# Altium project obc-comm v2.PrjPCB
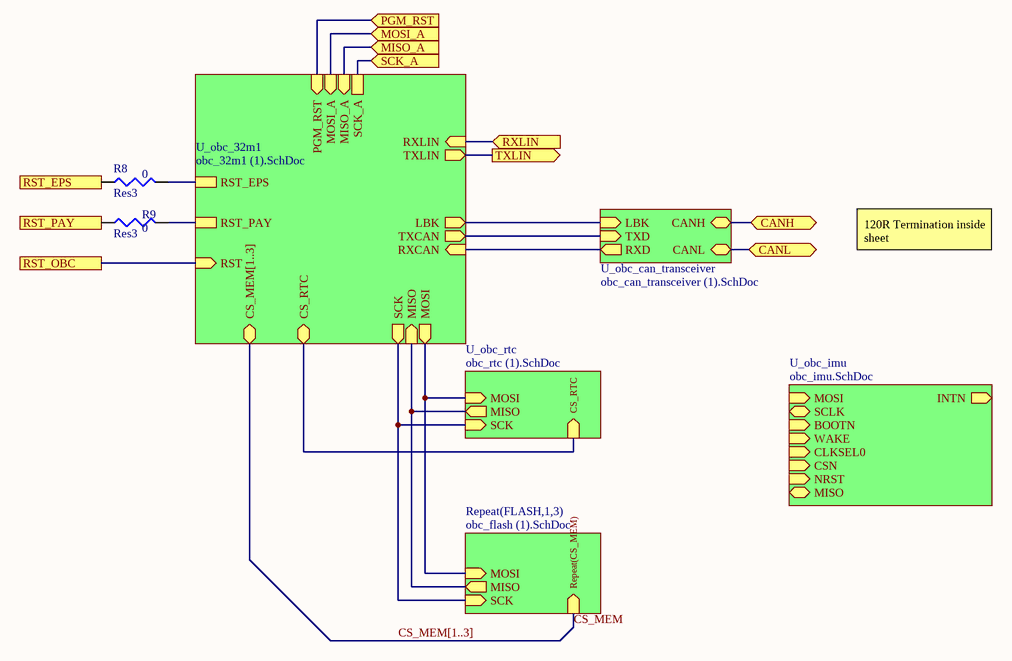
[diagram p0: obc_main_3.0 (1).SchDoc]
5 sheets, 56 parts. Net scope: hierarchical (ports join the sheet entries above them; power ports are global).
Board file: obc-comm v2.PcbDoc
Sheets:
  obc_main_3.0 (1).SchDoc
    U_obc_32m1 = obc_32m1 (1).SchDoc
    U_obc_can_transceiver = obc_can_transceiver (1).SchDoc
    FLASH1 = obc_flash (1).SchDoc
    FLASH2 = obc_flash (1).SchDoc
    FLASH3 = obc_flash (1).SchDoc
    U_obc_imu = obc_imu.SchDoc

## Sheet obc_main_3.0 (1).SchDoc
size A

### Parts
R8  Res3  value 0  [J1-0603]
R9  Res3  value 0  [J1-0603]

### Sub-sheets
Repeat(FLASH,1,3) = obc_flash (1).SchDoc: MOSI (in), SCK (in), MISO (out), Repeat(CS_MEM) (in)
U_obc_32m1 = obc_32m1 (1).SchDoc: MISO (in), SCK (out), RXLIN (in), CS_RTC (bidir), TXLIN (out), TXCAN (out), RXCAN (in), MOSI (out), LBK (out), RST (in), RST_EPS, RST_PAY, PGM_RST (in), MOSI_A (in), MISO_A (in), SCK_A, CS_MEM[1..3] (bidir)
U_obc_can_transceiver = obc_can_transceiver (1).SchDoc: RXD (out), TXD (in), LBK (in), CANL (bidir), CANH (bidir)
U_obc_imu = obc_imu.SchDoc: MOSI (in), SCLK (bidir), INTN (out), BOOTN (in), WAKE (in), CLKSEL0 (in), CSN (in), NRST (in), MISO (bidir)
U_obc_rtc = obc_rtc (1).SchDoc (file not in this document): CS_RTC (in), MOSI (in), MISO (out), SCK (in)

### Ports
CANH (bidir), CANL (bidir), MISO_A (in), MOSI_A (in), PGM_RST (in), RST_EPS, RST_OBC, RST_PAY, RXLIN (in), SCK_A (in), TXLIN (out)

### Nets
+3V3: sheet U_obc_imu/INTN, sheet U_obc_imu/BOOTN
CS_MEM: sheet Repeat(FLASH,1,3)/Repeat(CS_MEM)
MISO_A: port MISO_A, sheet U_obc_32m1/MISO_A
MOSI_A: port TXLIN, port MOSI_A, sheet U_obc_32m1/TXLIN, sheet U_obc_32m1/MOSI_A
RST: port RST_OBC, sheet U_obc_32m1/RST
RXCAN: sheet U_obc_32m1/RXCAN, sheet U_obc_can_transceiver/RXD
RXLIN: port RXLIN, sheet U_obc_32m1/RXLIN
TXCAN: sheet U_obc_32m1/TXCAN, sheet U_obc_can_transceiver/TXD
NetP1_3: port SCK_A, sheet U_obc_32m1/SCK_A
NetP1_5: port PGM_RST, sheet U_obc_32m1/PGM_RST
NetR8_1: R8.1 ; port RST_EPS
NetR8_2: R8.2 ; sheet U_obc_32m1/RST_EPS
NetR9_1: R9.1 ; port RST_PAY
NetR9_2: R9.2 ; sheet U_obc_32m1/RST_PAY
NetR28_1: port CANL, sheet U_obc_can_transceiver/CANL
NetR30_2: sheet U_obc_32m1/LBK, sheet U_obc_can_transceiver/LBK
NetR31_1: port CANH, sheet U_obc_can_transceiver/CANH
NetU1_8: sheet U_obc_32m1/MISO, sheet U_obc_rtc/MISO, sheet Repeat(FLASH,1,3)/MISO
NetU1_9: sheet U_obc_32m1/MOSI, sheet U_obc_rtc/MOSI, sheet Repeat(FLASH,1,3)/MOSI
NetU1_26: sheet U_obc_32m1/CS_RTC, sheet U_obc_rtc/CS_RTC
NetU1_28: sheet U_obc_32m1/SCK, sheet U_obc_rtc/SCK, sheet Repeat(FLASH,1,3)/SCK

### Buses and harness runs
bus CS_MEM[1..3] = sheet U_obc_32m1/CS_MEM[1..3]

### Notes on the sheet
- 120R Termination inside sheet

### Library data of the parts
R8 R9 = Res3: Resistor; Published: 8-Jun-2000; LatestRevisionDate: 29-May-2009; LatestRevisionNote: IPC-7351 Footprint Added.; PackageReference: J1-0603; Publisher: Altium Limited; PackageDescription: Chip Resistor

## Sheet obc_32m1 (1).SchDoc
size A4
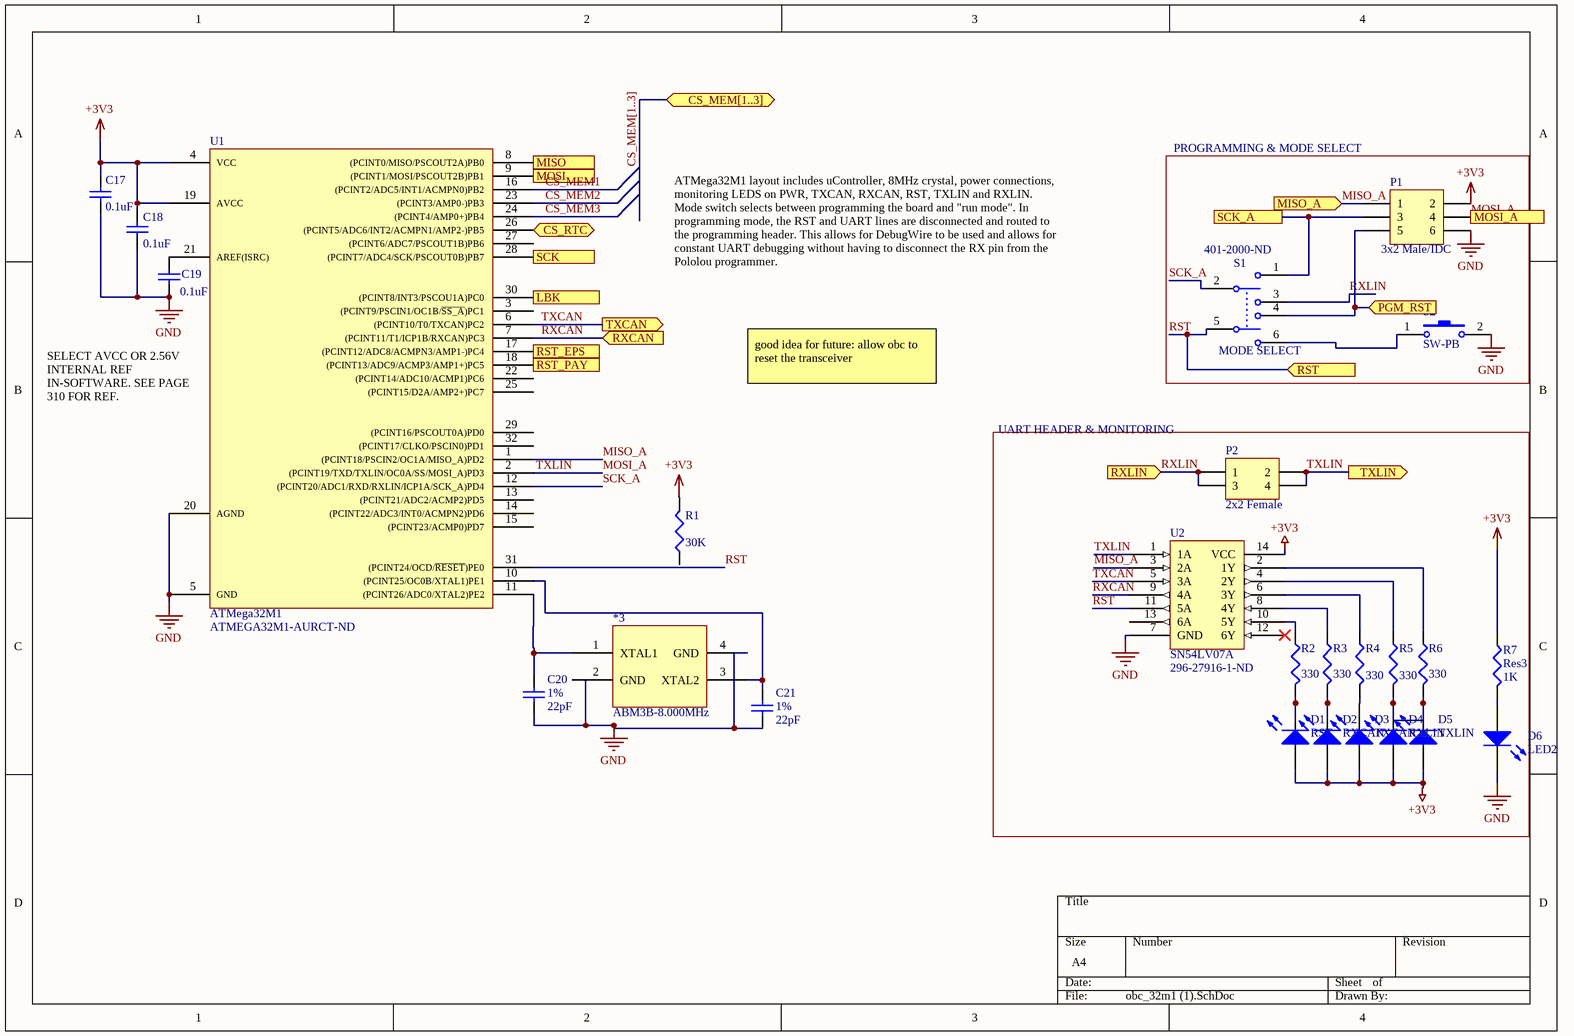
[diagram p1: obc_32m1 (1).SchDoc]

### Parts
*3  ABM3B-8.000MHz  [OSCSC500X320X110-4N]
C17  value 0.1uF  [1608[0603]]  (hidden comment: Cap Semi)
C18  value 0.1uF  [1608[0603]]  (hidden comment: Cap Semi)
C19  value 0.1uF  [1608[0603]]  (hidden comment: Cap Semi)
C20  1%  value 22pF  [1608[0603]]
C21  1%  value 22pF  [1608[0603]]
D1  RST  [1608[0603]]
D2  RXCAN  [1608[0603]]
D3  TXCAN  [1608[0603]]
D4  RXLIN  [1608[0603]]
D5  TXLIN  [1608[0603]]
D6  LED2  [1608[0603]]
P1  3x2 Male/IDC  [HDR2X3]
P2  2x2 Female  [HDR2X2]
R1  value 30K  [J1-0603]
R2  value 330  [J1-0603]  (hidden comment: Res3)
R3  value 330  [J1-0603]  (hidden comment: Res3)
R4  value 330  [J1-0603]  (hidden comment: Res3)
R5  value 330  [J1-0603]  (hidden comment: Res3)
R6  value 330  [J1-0603]  (hidden comment: Res3)
R7  Res3  value 1K  [J1-0603]
S1  MODE SELECT  Supplier Part Number: 401-2000-ND  [DPST_32m1_switch]
S2  SW-PB  [SW415-ND]
U1  ATMega32M1  Supplier Part Number 1: ATMEGA32M1-AURCT-ND  [QFP80P900X900X120-32N]
U2  SN54LV07A  Supplier Part Number: 296-27916-1-ND  [SOP65P640X120-14N]

### Blocks framed on the sheet
PROGRAMMING & MODE SELECT: P1 S1 S2
UART HEADER & MONITORING: D1-D6 P2 R2-R7 U2

### Ports
CS_MEM[1..3] (bidir), CS_RTC (bidir), LBK (out), MISO (in), MISO_A (in), MOSI (out), MOSI_A (in), PGM_RST (in), RST (in), RST_EPS, RST_PAY, RXCAN (in), RXLIN (in), SCK (out), SCK_A, TXCAN (out), TXLIN (out)

### Nets
+3V3: C17.2 C18.2 D1.1(A) D2.1(A) D3.1(A) D4.1(A) D5.1(A) P1.2 R1.2 R7.1 U1.4(VCC) U1.19(AVCC) U2.14(VCC)
GND: *3.4(GND) C17.1 C18.1 C19.2 C20.1 C21.1 D6.2(K) P1.6 S2.2 U1.5(GND) U1.20(AGND) U2.7(GND)
CS_MEM1: U1.16((PCINT2/ADC5/INT1/ACMPN0)PB2)
CS_MEM2: U1.23((PCINT3/AMP0-)PB3)
CS_MEM3: U1.24((PCINT4/AMP0+)PB4)
MISO_A: P1.1 U1.1((PCINT18/PSCIN2/OC1A/MISO_A)PD2) U2.3(2A) ; port MISO_A
MOSI_A: P1.4 P2.2 P2.4 U1.2((PCINT19/TXD/TXLIN/OC0A/SS/MOSI_A)PD3) U2.1(1A) ; port TXLIN, port MOSI_A  [also labelled TXLIN]
RST: S1.5 U1.31((PCINT24/OCD/~{RESET})PE0) U2.11(5A) ; port RST
RXCAN: U1.7((PCINT11/T1/ICP1B/RXCAN)PC3) U2.9(4A) ; port RXCAN
RXLIN: P2.1 P2.3 S1.3 ; port RXLIN
SCK_A: S1.2 U1.12((PCINT20/ADC1/RXD/RXLIN/ICP1A/SCK_A)PD4)
TXCAN: U1.6((PCINT10/T0/TXCAN)PC2) U2.5(3A) ; port TXCAN
Net*3_1: *3.1(XTAL1) C20.2 U1.11((PCINT26/ADC0/XTAL2)PE2)
Net*3_3: *3.3(XTAL2) C21.2 U1.10((PCINT25/OC0B/XTAL1)PE1)
NetC19_1: C19.1 U1.21(AREF(ISRC))
NetD1_2: D1.2(K) R2.2
NetD2_2: D2.2(K) R3.2
NetD3_2: D3.2(K) R4.2
NetD4_2: D4.2(K) D5.2(K) R5.2 R6.2
NetD6_1: D6.1(A) R7.2
NetP1_3: P1.3 S1.1 ; port SCK_A
NetP1_5: P1.5 S1.4 ; port PGM_RST
NetR2_1: R2.1 U2.10(5Y)
NetR3_1: R3.1 U2.8(4Y)
NetR4_1: R4.1 U2.6(3Y)
NetR5_1: R5.1 U2.4(2Y)
NetR6_1: R6.1 U2.2(1Y)
NetR8_2: U1.17((PCINT12/ADC8/ACMPN3/AMP1-)PC4) ; port RST_EPS
NetR9_2: U1.18((PCINT13/ADC9/ACMP3/AMP1+)PC5) ; port RST_PAY
NetR30_2: U1.30((PCINT8/INT3/PSCOU1A)PC0) ; port LBK
NetS1_6: S1.6 S2.1
NetU1_8: U1.8((PCINT0/MISO/PSCOUT2A)PB0) ; port MISO
NetU1_9: U1.9((PCINT1/MOSI/PSCOUT2B)PB1) ; port MOSI
NetU1_26: U1.26((PCINT5/ADC6/INT2/ACMPN1/AMP2-)PB5) ; port CS_RTC
NetU1_28: U1.28((PCINT7/ADC4/SCK/PSCOUT0B)PB7) ; port SCK

Not connected (* = marked no-connect by the designer): *3 2(GND); R1 1; U1 3((PCINT9/PSCIN1/OC1B/~{SS_A})PC1) 13((PCINT21/ADC2/ACMP2)PD5) 14((PCINT22/ADC3/INT0/ACMPN2)PD6) 15((PCINT23/ACMP0)PD7) 22((PCINT14/ADC10/ACMP1)PC6) 25((PCINT15/D2A/AMP2+)PC7) 27((PCINT6/ADC7/PSCOUT1B)PB6) 29((PCINT16/PSCOUT0A)PD0) 32((PCINT17/CLKO/PSCIN0)PD1); U2 12(6Y)* 13(6A)

### Buses and harness runs
bus CS_MEM[1..3] = port CS_MEM[1..3]

### Notes on the sheet
- ATMega32M1 layout includes uController, 8MHz crystal, power connections, monitoring LEDS on PWR, TXCAN, RXCAN, RST, TXLIN and RXLIN. Mode switch selects between programming the board and "run mode". In programming mode, the RST and UART lines are disconnected and routed to the programming header. This allows for DebugWire to be used and allows for constant UART debugging without having to disconnect the RX pin from the Pololou programmer.
- good idea for future: allow obc to reset the transceiver
- (near U1) SELECT AVCC OR 2.56V INTERNAL REF IN-SOFTWARE. SEE PAGE 310 FOR REF.

### Library data of the parts
C17-C21 = Cap Semi: Capacitor (Semiconductor SIM Model); Published: 8-Jun-2000; LatestRevisionDate: 29-May-2009; LatestRevisionNote: IPC-7351 Footprint Added.; PackageReference: C1206; Publisher: Altium Limited; PackageDescription: Chip Capacitor
D1-D6 = LED2: Typical RED, GREEN, YELLOW, AMBER GaAs LED; Published: 8-Jun-2000; LatestRevisionDate: 17-Jul-2002; LatestRevisionNote: Re-released for DXP Platform.; PackageVersion: Feb-2002; PackageReference: 3.2X1.6X1.1; Publisher: Altium Limited; PackageDescription: SM LED; 2 Flat Leads
P1 = Header 3X2: 2x3 through-hole programming header, IDC; LatestRevisionDate: 17-Jul-2002; LatestRevisionNote: Re-released for DXP Platform.; Publisher: Altium Limited
P2 = Header 2X2: Header, 2-Pin, Dual row; LatestRevisionDate: 17-Jul-2002; LatestRevisionNote: Re-released for DXP Platform.; Publisher: Altium Limited
R1 = Res3: 30K Pull-up resistor for RST. See page; Published: 8-Jun-2000; LatestRevisionDate: 29-May-2009; LatestRevisionNote: IPC-7351 Footprint Added.; PackageReference: J1-0603; Publisher: Altium Limited; PackageDescription: Chip Resistor
R2-R7 = Res3: Resistor; Published: 8-Jun-2000; LatestRevisionDate: 29-May-2009; LatestRevisionNote: IPC-7351 Footprint Added.; PackageReference: J1-0603; Publisher: Altium Limited; PackageDescription: Chip Resistor
S1 = SW-DPDT: Double-Pole, Double-Throw Switch; Published: 24-Mar-1999; LatestRevisionDate: 17-Jul-2002; LatestRevisionNote: Re-released for DXP Platform.; PackageReference: DPDT-6; Publisher: Altium Limited; PackageDescription: Switch; 6 Leads; Supplier: Digi-Key
S2 = SW-PB: Switch; Published: 24-Mar-1999; LatestRevisionDate: 17-Jul-2002; LatestRevisionNote: Re-released for DXP Platform.; PackageReference: SPST-2; Publisher: Altium Limited; PackageDescription: Switch; 2 Leads
U1 = ATMega32M1: Atmel 8-bit AVR microcontroller.; Supplier 1: Digi-Key
U2 = SN54LV07A: Six element 1-bit non-inverting open-drain buffer.; Supplier: Digi-Key

## Sheet obc_can_transceiver (1).SchDoc
size A4
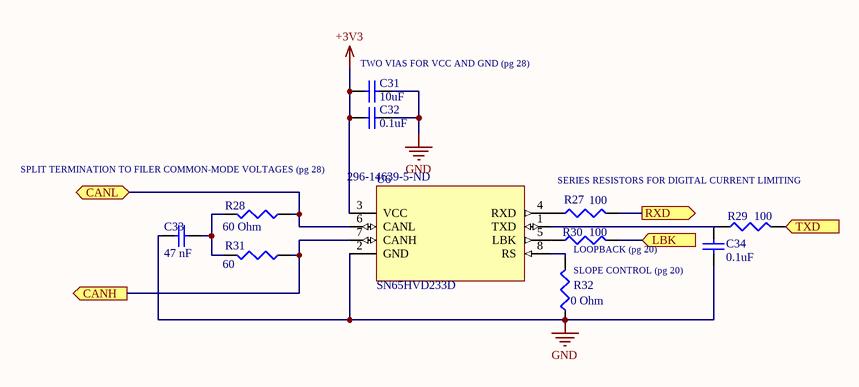
[diagram p2: obc_can_transceiver (1).SchDoc]

### Parts
C31  value 10uF  [1608[0603]]  (hidden comment: Cap Semi)
C32  value 0.1uF  [1608[0603]]  (hidden comment: Cap Semi)
C33  value 47 nF  [1608[0603]]  (hidden comment: Ceramic)
C34  0.1uF  [1608[0603]]
R27  value 100  [J1-0603]
R28  value 60 Ohm  [J1-0603]  (hidden comment: 0603)
R29  value 100  [J1-0603]
R30  100  [J1-0603]
R31  value 60  [J1-0603]  (hidden comment: 0603)
R32  value 0 Ohm  [J1-0603]
U6  SN65HVD233D  Supplier Part Number 1: 296-14639-5-ND  [SOIC127P500X600-8N]

### Ports
CANH (out), CANL (bidir), LBK (in), RXD (out), TXD (in)

### Nets
+3V3: C31.2 C32.2 U6.3(VCC)
GND: C31.1 C32.1 C33.1 C34.1 R32.1 U6.2(GND)
RXCAN: R27.2 ; port RXD
TXCAN: R29.2 ; port TXD
NetC33_2: C33.2 R28.2 R31.2
NetC34_2: C34.2 R29.1 U6.1(TXD)
NetR27_1: R27.1 U6.4(RXD)
NetR28_1: R28.1 U6.6(CANL) ; port CANL
NetR30_1: R30.1 U6.5(LBK)
NetR30_2: R30.2 ; port LBK
NetR31_1: R31.1 U6.7(CANH) ; port CANH
NetR32_2: R32.2 U6.8(RS)

### Notes on the sheet
- (near C31) TWO VIAS FOR VCC AND GND (pg 28)
- SPLIT TERMINATION TO FILER COMMON-MODE VOLTAGES (pg 28)
- SERIES RESISTORS FOR DIGITAL CURRENT LIMITING
- (near R32) SLOPE CONTROL (pg 20)
- (near R30) LOOPBACK (pg 20)

### Library data of the parts
C31-C34 = Cap Semi: Capacitor (Semiconductor SIM Model); Published: 8-Jun-2000; LatestRevisionDate: 29-May-2009; LatestRevisionNote: IPC-7351 Footprint Added.; PackageReference: C1206; Publisher: Altium Limited; PackageDescription: Chip Capacitor
  C34: Value: 0.1uF
R27-R32 = Res3: Resistor; Published: 8-Jun-2000; LatestRevisionDate: 29-May-2009; LatestRevisionNote: IPC-7351 Footprint Added.; PackageReference: J1-0603; Publisher: Altium Limited; PackageDescription: Chip Resistor
  R30: Value: 100
U6 = SN65HVD233D: 3.3V CAN Transceiver with Standby Mode, Loop-back 8-SOIC -40 to 125; MF: Texas Instruments; MP: SN65HVD233D; Package: SOIC-8 Texas Instruments; Availability: Good; SnapEDA_Link: https://www.snapeda.com/parts/SN65HVD233D/Texas%20Instruments/view-part/?ref=snap; Price: 2.39 USD; Value: *; Supplier 1: Digi-Key

## Sheet obc_flash (1).SchDoc
size A4
Used 3 times, as channels FLASH1, FLASH2, FLASH3. Parts and nets are listed once, with the designators drawn on the sheet.
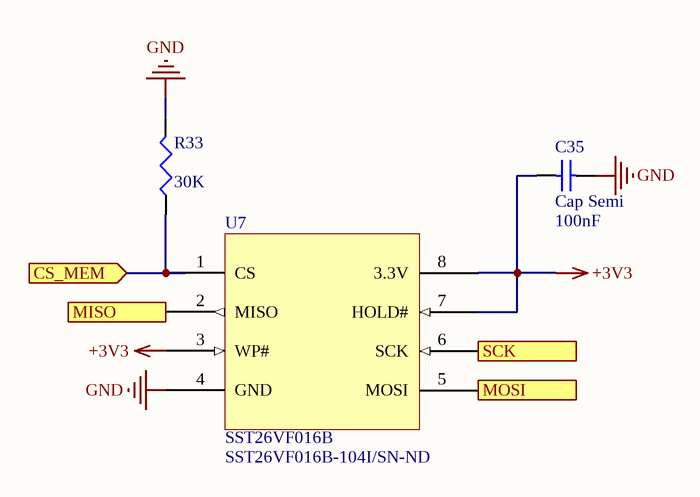
[diagram p3: obc_flash (1).SchDoc]

### Parts
C35  Cap Semi  value 100nF  [1608[0603]]
R33  value 30K  [J1-0603]
U7  SST26VF016B  Supplier Part Number 1: SST26VF016B-104I/SN-ND  [SOIC127P500X600-8N]

### Ports
CS_MEM (in), MISO (out), MOSI (in), SCK (in)

### Nets
+3V3: C35.1 U7.3(WP#) U7.7(HOLD#) U7.8(3.3V)
GND: C35.2 R33.2 U7.4(GND)
CS_MEM: R33.1 U7.1(CS) ; port CS_MEM
MISO: U7.2(MISO) ; port MISO
MOSI: U7.5(MOSI) ; port MOSI
SCK: U7.6(SCK) ; port SCK

### Channels
FLASH1: designators end in _FLASH1; ports CS_MEM=CS_MEM1 MISO=NetU1_8 MOSI=NetU1_9 SCK=NetU1_28
FLASH2: designators end in _FLASH2; ports CS_MEM=CS_MEM2 MISO=NetU1_8 MOSI=NetU1_9 SCK=NetU1_28
FLASH3: designators end in _FLASH3; ports CS_MEM=CS_MEM3 MISO=NetU1_8 MOSI=NetU1_9 SCK=NetU1_28

### Library data of the parts
C35 = Cap Semi: Capacitor (Semiconductor SIM Model); Published: 8-Jun-2000; LatestRevisionDate: 29-May-2009; LatestRevisionNote: IPC-7351 Footprint Added.; PackageReference: C1206; Publisher: Altium Limited; PackageDescription: Chip Capacitor
R33 = Res3: 30K Pull-up resistor for RST. See page; Published: 8-Jun-2000; LatestRevisionDate: 29-May-2009; LatestRevisionNote: IPC-7351 Footprint Added.; PackageReference: J1-0603; Publisher: Altium Limited; PackageDescription: Chip Resistor
U7 = SST26VF016B: 2.5V/3.0V 16 Mbit Serial Quad I/O (SQI) Flash Memory; ComponentLink1Description: SST25VF016B; ComponentLink1URL: https://www.digikey.ca/product-detail/en/microchip-technology/SST26VF016B-104I-SN/SST26VF016B-104I-SN-ND/5033651; Supplier 1: Digi-Key

## Sheet obc_imu.SchDoc
size A
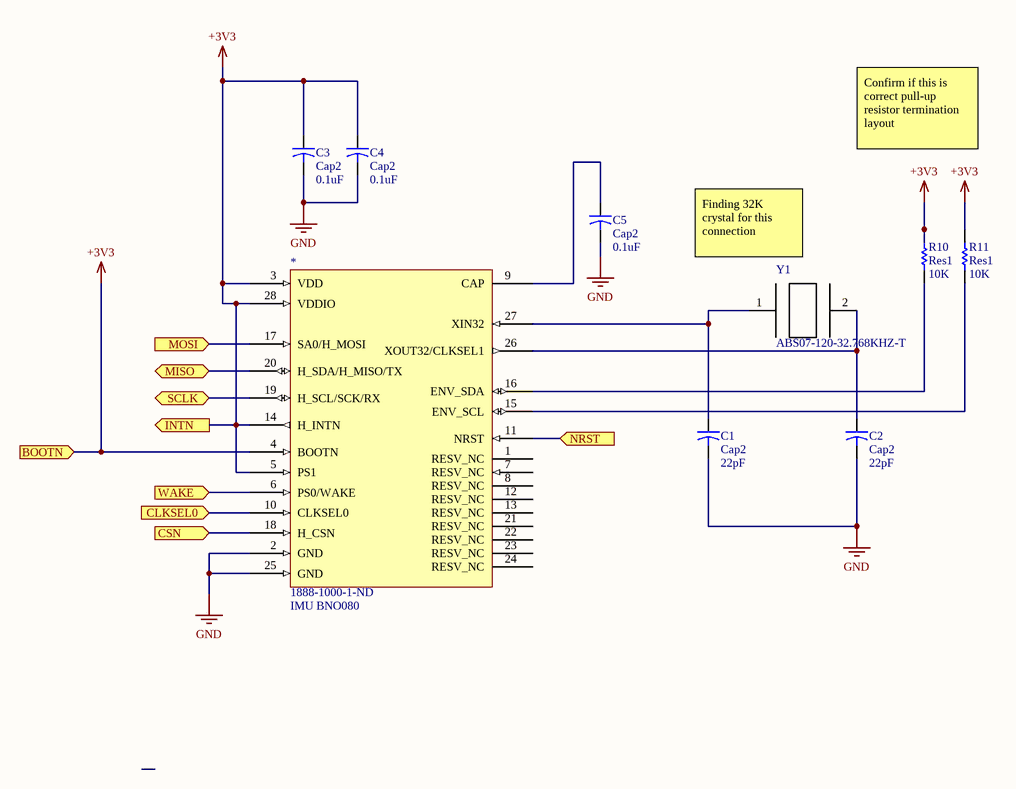
[diagram p4: obc_imu.SchDoc]

### Parts
*  IMU BNO080
C1  Cap2  value 22pF  [CAPR5-4X5]
C2  Cap2  value 22pF  [CAPR5-4X5]
C3  Cap2  value 0.1uF  [CAPR5-4X5]
C4  Cap2  value 0.1uF  [CAPR5-4X5]
C5  Cap2  value 0.1uF  [CAPR5-4X5]
R10  Res1  value 10K  [AXIAL-0.3]
R11  Res1  value 10K  [AXIAL-0.3]
Y1  ABS07-120-32.768KHZ-T  [XTAL_ABS07-120-32.768KHZ-T]

### Ports
BOOTN (in), CLKSEL0 (in), CSN (in), INTN (out), MISO (bidir), MOSI (in), NRST (in), SCLK (bidir), WAKE (in)

### Nets
+3V3: *.3(VDD) *.4(BOOTN) *.5(PS1) *.14(H_INTN) *.28(VDDIO) C3.1 C4.1 R10.2 R11.2 ; port INTN, port BOOTN
GND: *.2(GND) *.25(GND) C1.2 C2.2 C3.2 C4.2 C5.2
Net*_6: *.6(PS0/WAKE) ; port WAKE
Net*_9: *.9(CAP) C5.1
Net*_10: *.10(CLKSEL0) ; port CLKSEL0
Net*_11: *.11(NRST) ; port NRST
Net*_15: *.15(ENV_SCL) R11.1
Net*_16: *.16(ENV_SDA) R10.1
Net*_17: *.17(SA0/H_MOSI) ; port MOSI
Net*_18: *.18(H_CSN) ; port CSN
Net*_19: *.19(H_SCL/SCK/RX) ; port SCLK
Net*_20: *.20(H_SDA/H_MISO/TX) ; port MISO
Net*_26: *.26(XOUT32/CLKSEL1) C2.1 Y1.2
Net*_27: *.27(XIN32) C1.1 Y1.1

Not connected (* = marked no-connect by the designer): * 1(RESV_NC) 7(RESV_NC) 8(RESV_NC) 12(RESV_NC) 13(RESV_NC) 21(RESV_NC) 22(RESV_NC) 23(RESV_NC) 24(RESV_NC)

### Notes on the sheet
- Confirm if this is correct pull-up resistor termination layout
- Finding 32K crystal for this connection
- (in symbol IMU BNO080) 1888-1000-1-ND

### Library data of the parts
* = IMU BNO080: ACCEL/GYRO/MAG I2C 32BIT
C1-C5 = Cap2: Capacitor; Published: 23-Sep-2002; PackageReference: CAPR5-4X5; Publisher: Altium Limited; PackageDescription: Capacitor; 2 Leads
R10 R11 = Res1: Resistor; Published: 8-Jun-2000; LatestRevisionDate: 17-Jul-2002; LatestRevisionNote: Re-released for DXP Platform.; PackageReference: AXIAL-0.3; Publisher: Altium Limited; PackageDescription: Axial Device, Thru-Hole; 2 Leads; 0.3 in Pin Spacing
Y1 = ABS07-120-32.768KHZ-T: 3.2 x 1.5mm, 32.768KHZ Xtal 6pf, 20ppm, -40+85C, ESR 60kOhm, ST Micro Ref Design Crystal for STM32L; MF: Abracon; MP: ABS07-120-32.768KHZ-T; SnapEDA_Link: https://www.snapeda.com/parts/ABS07-120-32.768KHZ-T/Abracon%20LLC/view-part/?ref=snap; Package: SMD-2 Abracon; Price: 0.37 USD; Availability: Good; Value: *

## Nets that join several sheets
+3V3: obc_32m1 (1) (13 pins), obc_can_transceiver (1) (C31.2 C32.2 U6.3), FLASH1 (C35_FLASH1.1 U7_FLASH1.3 U7_FLASH1.7 U7_FLASH1.8), FLASH2 (C35_FLASH2.1 U7_FLASH2.3 U7_FLASH2.7 U7_FLASH2.8), FLASH3 (C35_FLASH3.1 U7_FLASH3.3 U7_FLASH3.7 U7_FLASH3.8), obc_imu (9 pins)
GND: obc_32m1 (1) (12 pins), obc_can_transceiver (1) (6 pins), FLASH1 (C35_FLASH1.2 R33_FLASH1.2 U7_FLASH1.4), FLASH2 (C35_FLASH2.2 R33_FLASH2.2 U7_FLASH2.4), FLASH3 (C35_FLASH3.2 R33_FLASH3.2 U7_FLASH3.4), obc_imu (7 pins)
CS_MEM1: obc_32m1 (1) (U1.16), FLASH1 (R33_FLASH1.1 U7_FLASH1.1)
CS_MEM2: obc_32m1 (1) (U1.23), FLASH2 (R33_FLASH2.1 U7_FLASH2.1)
CS_MEM3: obc_32m1 (1) (U1.24), FLASH3 (R33_FLASH3.1 U7_FLASH3.1)
NetR8_2: obc_main_3.0 (1) (R8.2), obc_32m1 (1) (U1.17)
NetR9_2: obc_main_3.0 (1) (R9.2), obc_32m1 (1) (U1.18)
NetR30_2: obc_32m1 (1) (U1.30), obc_can_transceiver (1) (R30.2)
NetU1_8: obc_32m1 (1) (U1.8), FLASH1 (U7_FLASH1.2), FLASH2 (U7_FLASH2.2), FLASH3 (U7_FLASH3.2)
NetU1_9: obc_32m1 (1) (U1.9), FLASH1 (U7_FLASH1.5), FLASH2 (U7_FLASH2.5), FLASH3 (U7_FLASH3.5)
NetU1_28: obc_32m1 (1) (U1.28), FLASH1 (U7_FLASH1.6), FLASH2 (U7_FLASH2.6), FLASH3 (U7_FLASH3.6)
RXCAN: obc_32m1 (1) (U1.7 U2.9), obc_can_transceiver (1) (R27.2)
TXCAN: obc_32m1 (1) (U1.6 U2.5), obc_can_transceiver (1) (R29.2)